# Altium schematic sheet handwriting_Sheet1.SchDoc
size B
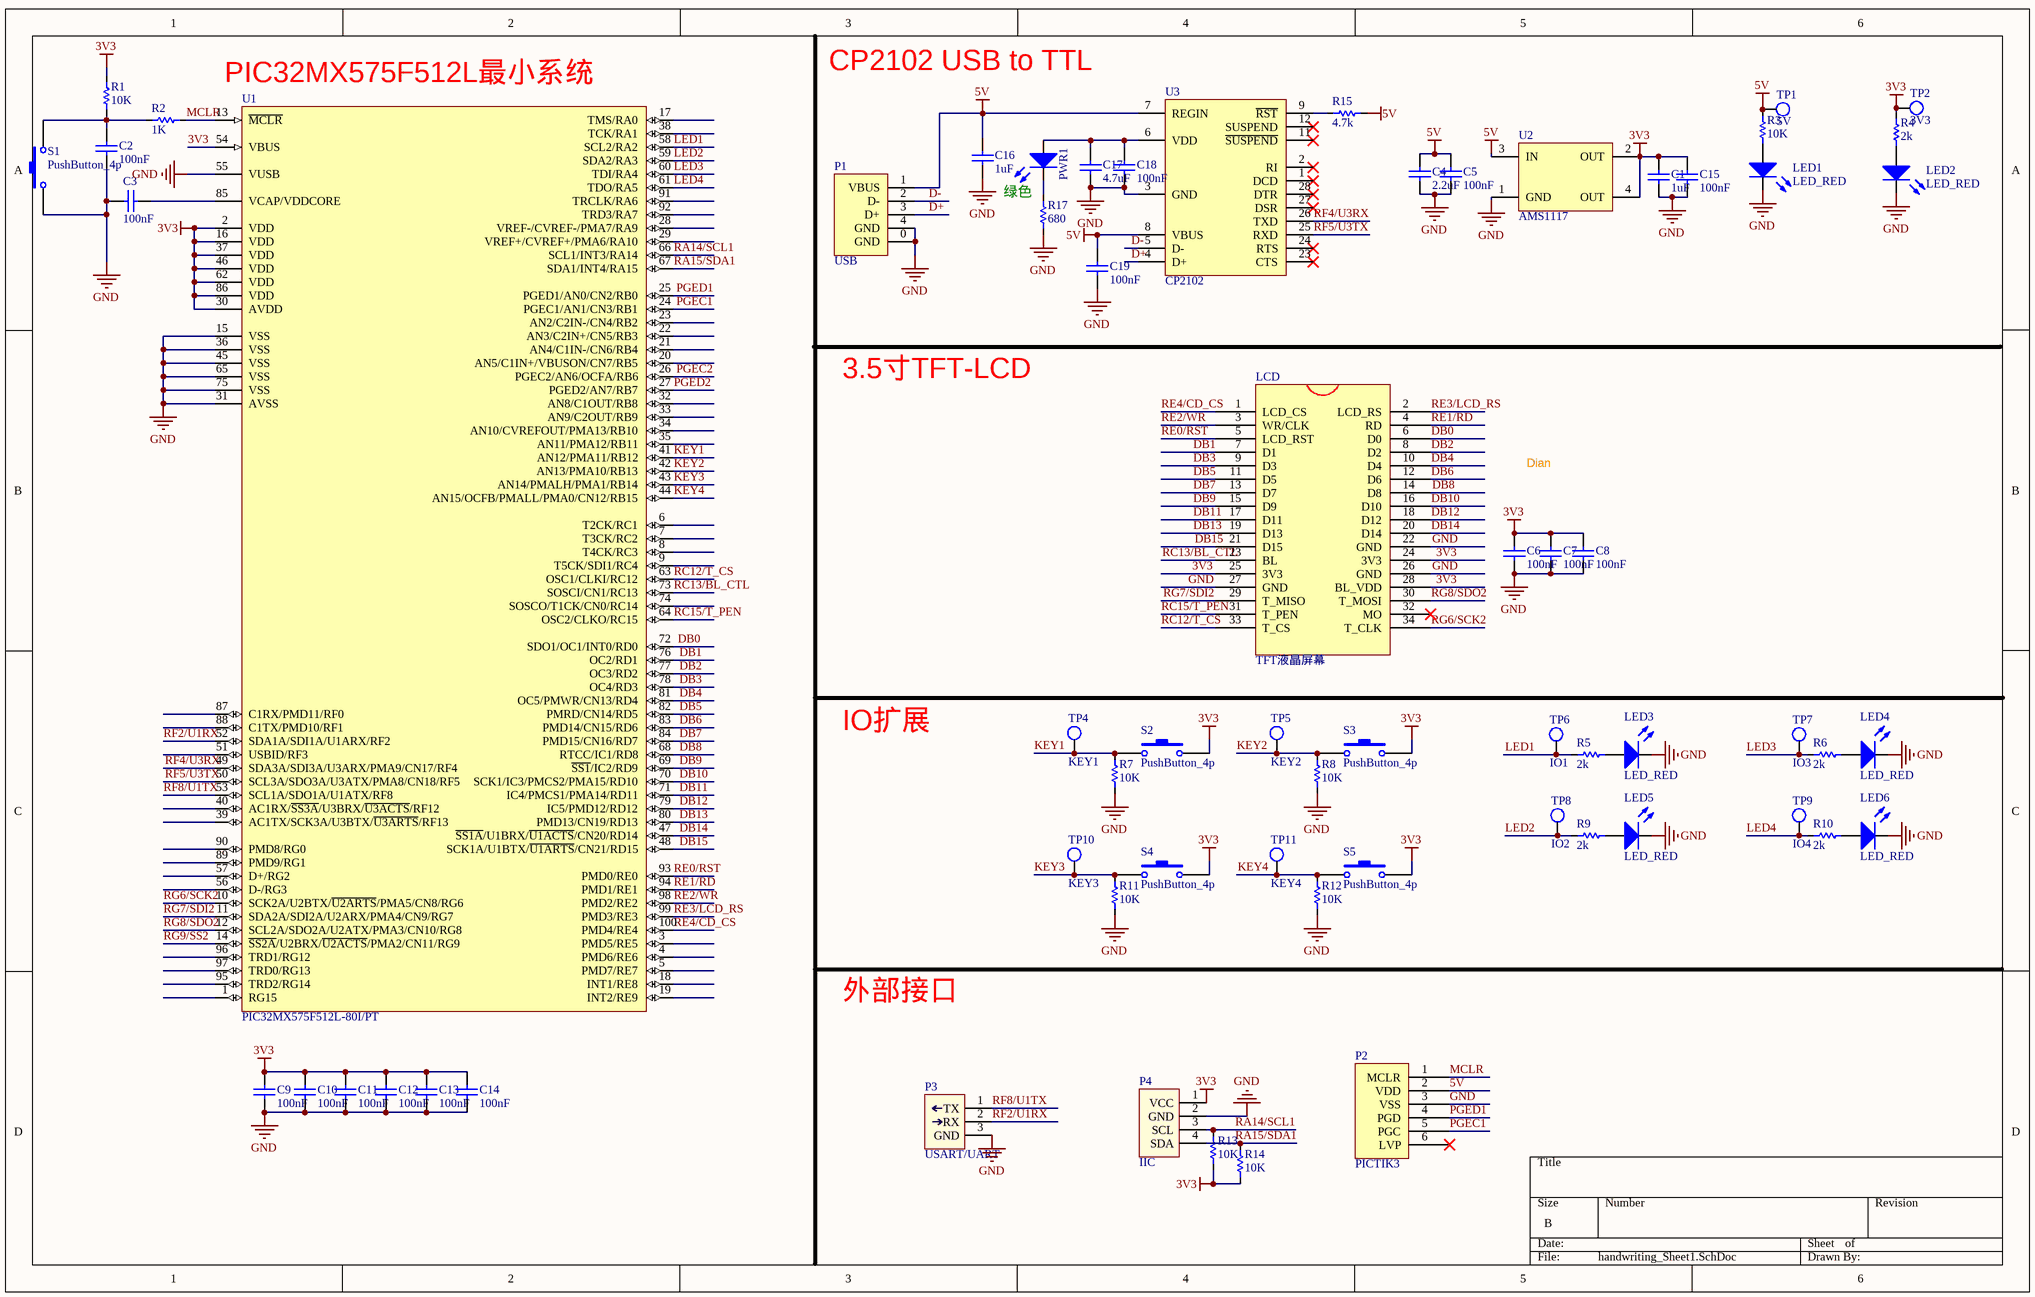
[diagram p0: handwriting_Sheet1.SchDoc]

## Parts
*  Dian_logo  [Dian_logo]  (value not drawn)
C1  1uF  [0603C]
C2  100nF  [0603C]
C3  100nF  [0603C]
C4  2.2uF  [0603C]
C5  100nF  [0603C]
C6  100nF  [0603C]
C7  100nF  [0603C]
C8  100nF  [0603C]
C9  100nF  [0603C]
C10  100nF  [0603C]
C11  100nF  [0603C]
C12  100nF  [0603C]
C13  100nF  [0603C]
C14  100nF  [0603C]
C15  100nF  [0603C]
C16  1uF  [0603C]
C17  4.7uF  [0603C]
C18  100nF  [0603C]
C19  100nF  [0603C]
LCD  TFT液晶屏幕  [TFT液晶屏]
LED1  LED_RED  [0603LED]
LED2  LED_RED  [0603LED]
LED3  LED_RED  [0603LED]
LED4  LED_RED  [0603LED]
LED5  LED_RED  [0603LED]
LED6  LED_RED  [0603LED]
P1  USB  [MICRO_USB_四脚]
P2  PICTIK3  [Pictik3]
P3  USART/UART  [HEADER 3x1 M]
P4  IIC  [HEADER 4x1]
PWR1  LED_RED  [0603led]  (value not drawn)
R1  10K  [0603R]
R2  1K  [0603R]
R3  10K  [0603R]
R4  2k  [0603R]
R5  2k  [0603R]
R6  2k  [0603R]
R7  10K  [0603R]
R8  10K  [0603R]
R9  2k  [0603R]
R10  2k  [0603R]
R11  10K  [0603R]
R12  10K  [0603R]
R13  10K  [0603R]
R14  10K  [0603R]
R15  4.7k  [0603R]
R17  680  [0603R]
S1  PushButton_4p  [SW-6x6mm]
S2  PushButton_4p  [SW-6x6mm]
S3  PushButton_4p  [SW-6x6mm]
S4  PushButton_4p  [SW-6x6mm]
S5  PushButton_4p  [SW-6x6mm]
TP1  5V  [TP_SMT]
TP2  3V3  [TP_SMT]
TP4  KEY1  [TP_SMT]
TP5  KEY2  [TP_SMT]
TP6  IO1  [TP_SMT]
TP7  IO3  [TP_SMT]
TP8  IO2  [TP_SMT]
TP9  IO4  [TP_SMT]
TP10  KEY3  [TP_SMT]
TP11  KEY4  [TP_SMT]
U1  PIC32MX575F512L-80I/PT  [TQFP-PT100_N]
U2  AMS1117  [SOT223_4]
U3  CP2102  [QFN-28_5x5x05P]

## Nets
3V3: C1.1 C6.2 C7.2 C8.2 C9.2 C10.2 C11.2 C12.2 C13.2 C14.2 C15.2 LCD.24(3V3) LCD.25(3V3) LCD.28(BL_VDD) P4.1(VCC) R1.2 R4.2 R13.1 R14.1 S2.2 S3.2 S4.2 S5.2 TP2.1(TP) U1.2(VDD) U1.16(VDD) U1.30(AVDD) U1.37(VDD) U1.46(VDD) U1.54(VBUS) U1.62(VDD) U1.86(VDD) U2.2(OUT) U2.4(OUT)
5V: C4.2 C5.2 C16.2 C19.2 P1.1(VBUS) P2.2(VDD) R3.2 R15.2 TP1.1(TP) U2.3(IN) U3.7(REGIN) U3.8(VBUS)
GND: C1.2 C2.1 C3.2 C4.1 C5.1 C6.1 C7.1 C8.1 C9.1 C10.1 C11.1 C12.1 C13.1 C14.1 C15.1 C16.1 C17.1 C18.1 C19.1 LCD.22(GND) LCD.26(GND) LCD.27(GND) LED1.2 LED2.2 LED3.2 LED4.2 LED5.2 LED6.2 P1.0(GND) P1.4(GND) P2.3(VSS) P3.3(GND) P4.2(GND) R7.1 R8.1 R11.1 R12.1 R17.1 S1.1 U1.15(VSS) U1.31(AVSS) U1.36(VSS) U1.45(VSS) U1.55(VUSB) U1.65(VSS) U1.75(VSS) U2.1(GND) U3.3(GND) U3.29(PAD)
D+: P1.3(D+) U3.4(D+)
D-: P1.2(D-) U3.5(D-)
DB0: LCD.6(D0) U1.72(SDO1/OC1/INT0/RD0)
DB1: LCD.7(D1) U1.76(OC2/RD1)
DB2: LCD.8(D2) U1.77(OC3/RD2)
DB3: LCD.9(D3) U1.78(OC4/RD3)
DB4: LCD.10(D4) U1.81(OC5/PMWR/CN13/RD4)
DB5: LCD.11(D5) U1.82(PMRD/CN14/RD5)
DB6: LCD.12(D6) U1.83(PMD14/CN15/RD6)
DB7: LCD.13(D7) U1.84(PMD15/CN16/RD7)
DB8: LCD.14(D8) U1.68(RTCC/IC1/RD8)
DB9: LCD.15(D9) U1.69(~{SS1}/IC2/RD9)
DB10: LCD.16(D10) U1.70(SCK1/IC3/PMCS2/PMA15/RD10)
DB11: LCD.17(D11) U1.71(IC4/PMCS1/PMA14/RD11)
DB12: LCD.18(D12) U1.79(IC5/PMD12/RD12)
DB13: LCD.19(D13) U1.80(PMD13/CN19/RD13)
DB14: LCD.20(D14) U1.47(~{SS1A}/U1BRX/~{U1ACTS}/CN20/RD14)
DB15: LCD.21(D15) U1.48(SCK1A/U1BTX/~{U1ARTS}/CN21/RD15)
KEY1: R7.2 S2.1 TP4.1(TP) U1.41(AN12/PMA11/RB12)
KEY2: R8.2 S3.1 TP5.1(TP) U1.42(AN13/PMA10/RB13)
KEY3: R11.2 S4.1 TP10.1(TP) U1.43(AN14/PMALH/PMA1/RB14)
KEY4: R12.2 S5.1 TP11.1(TP) U1.44(AN15/OCFB/PMALL/PMA0/CN12/RB15)
LED1: R5.2 TP6.1(TP) U1.58(SCL2/RA2)
LED2: R9.2 TP8.1(TP) U1.59(SDA2/RA3)
LED3: R6.2 TP7.1(TP) U1.60(TDI/RA4)
LED4: R10.2 TP9.1(TP) U1.61(TDO/RA5)
MCLR: P2.1(MCLR) R2.1 U1.13(~{MCLR})
PGEC1: P2.5(PGC) U1.24(PGEC1/AN1/CN3/RB1)
PGEC2: U1.26(PGEC2/AN6/OCFA/RB6)
PGED1: P2.4(PGD) U1.25(PGED1/AN0/CN2/RB0)
PGED2: U1.27(PGED2/AN7/RB7)
RA14/SCL1: P4.3(SCL) R13.2 U1.66(SCL1/INT3/RA14)
RA15/SDA1: P4.4(SDA) R14.2 U1.67(SDA1/INT4/RA15)
RC12/T_CS: LCD.33(T_CS) U1.63(OSC1/CLKI/RC12)
RC13/BL_CTL: LCD.23(BL) U1.73(SOSCI/CN1/RC13)
RC15/T_PEN: LCD.31(T_PEN) U1.64(OSC2/CLKO/RC15)
RE0/RST: LCD.5(LCD_RST) U1.93(PMD0/RE0)
RE1/RD: LCD.4(RD) U1.94(PMD1/RE1)
RE2/WR: LCD.3(WR/CLK) U1.98(PMD2/RE2)
RE3/LCD_RS: LCD.2(LCD_RS) U1.99(PMD3/RE3)
RE4/CD_CS: LCD.1(LCD_CS) U1.100(PMD4/RE4)
RF2/U1RX: P3.2(RX) U1.52(SDA1A/SDI1A/U1ARX/RF2)
RF4/U3RX: U1.49(SDA3A/SDI3A/U3ARX/PMA9/CN17/RF4) U3.26(TXD)
RF5/U3TX: U1.50(SCL3A/SDO3A/U3ATX/PMA8/CN18/RF5) U3.25(RXD)
RF8/U1TX: P3.1(TX) U1.53(SCL1A/SDO1A/U1ATX/RF8)
RG6/SCK2: LCD.34(T_CLK) U1.10(SCK2A/U2BTX/~{U2ARTS}/PMA5/CN8/RG6)
RG7/SDI2: LCD.29(T_MISO) U1.11(SDA2A/SDI2A/U2ARX/PMA4/CN9/RG7)
RG8/SDO2: LCD.30(T_MOSI) U1.12(SCL2A/SDO2A/U2ATX/PMA3/CN10/RG8)
RG9/SS2: U1.14(~{SS2A}/U2BRX/~{U2ACTS}/PMA2/CN11/RG9)
NetC2_2: C2.2 R1.1 R2.2 S1.2
NetC3_1: C3.1 U1.85(VCAP/VDDCORE)
NetC17_2: C17.2 C18.2 PWR1.1 U3.6(VDD)
NetLED1_1: LED1.1 R3.1
NetLED2_1: LED2.1 R4.1
NetLED3_1: LED3.1 R5.1
NetLED4_1: LED4.1 R6.1
NetLED5_1: LED5.1 R9.1
NetLED6_1: LED6.1 R10.1
NetPWR1_2: PWR1.2 R17.2
NetR15_1: R15.1 U3.9(~{RST})

Not connected (* = marked no-connect by the designer): LCD 32(MO)*; P2 6(LVP)*; S1 3 4; S2 3 4; S3 3 4; S4 3 4; S5 3 4; U1 1(RG15) 3(PMD5/RE5) 4(PMD6/RE6) 5(PMD7/RE7) 6(T2CK/RC1) 7(T3CK/RC2) 8(T4CK/RC3) 9(T5CK/SDI1/RC4) 17(TMS/RA0) 18(INT1/RE8) 19(INT2/RE9) 20(AN5/C1IN+/VBUSON/CN7/RB5) 21(AN4/C1IN-/CN6/RB4) 22(AN3/C2IN+/CN5/RB3) 23(AN2/C2IN-/CN4/RB2) 28(VREF-/CVREF-/PMA7/RA9) 29(VREF+/CVREF+/PMA6/RA10) 32(AN8/C1OUT/RB8) 33(AN9/C2OUT/RB9) 34(AN10/CVREFOUT/PMA13/RB10) 35(AN11/PMA12/RB11) 38(TCK/RA1) 39(AC1TX/SCK3A/U3BTX/~{U3ARTS}/RF13) 40(AC1RX/~{SS3A}/U3BRX/~{U3ACTS}/RF12) 51(USBID/RF3) 56(D-/RG3) 57(D+/RG2) 74(SOSCO/T1CK/CN0/RC14) 87(C1RX/PMD11/RF0) 88(C1TX/PMD10/RF1) 89(PMD9/RG1) 90(PMD8/RG0) 91(TRCLK/RA6) 92(TRD3/RA7) 95(TRD2/RG14) 96(TRD1/RG12) 97(TRD0/RG13); U3 1(DCD)* 2(RI)* 11(~{SUSPEND})* 12(SUSPEND)* 23(CTS)* 24(RTS)* 27(DSR)* 28(DTR)*

## Notes on the sheet
- (near U1) PIC32MX575F512L最小系统
- CP2102 USB to TTL
- 绿色
- 3.5寸TFT-LCD
- IO扩展
- 外部接口
- (in symbol Dian_logo) Dian

## Library data of the parts
C1-C19 = Cap: Capacitor; Value: 100pF; Published: 8-Jun-2000; LatestRevisionDate: 17-Jul-2002; LatestRevisionNote: Re-released for DXP Platform.; PackageReference: RAD-0.3; Publisher: Altium Limited; PackageDescription: Radial Cap, Thru-Hole; 2 Leads; 0.3 in Pin Spacing
LCD = TFT液晶屏幕: 原子外部接口
LED1-LED6 PWR1 = LED: Typical RED, GREEN, YELLOW, AMBER GaAs LED; Published: 8-Jun-2000; LatestRevisionDate: 17-Jul-2002; LatestRevisionNote: Re-released for DXP Platform.; PackageVersion: Feb-2002; PackageReference: 3.2X1.6X1.1; Publisher: Altium Limited; PackageDescription: SM LED; 2 Flat Leads
P3 = UART_3pin
R1 R3-R15 R17 = Res1: Resistor; Value: 1K; Published: 8-Jun-2000; LatestRevisionDate: 17-Jul-2002; LatestRevisionNote: Re-released for DXP Platform.; PackageReference: AXIAL-0.3; Publisher: Altium Limited; PackageDescription: Axial Device, Thru-Hole; 2 Leads; 0.3 in Pin Spacing
R2 = Res1: Resistor; Published: 8-Jun-2000; LatestRevisionDate: 17-Jul-2002; LatestRevisionNote: Re-released for DXP Platform.; PackageReference: AXIAL-0.3; Publisher: Altium Limited; PackageDescription: Axial Device, Thru-Hole; 2 Leads; 0.3 in Pin Spacing; Value: 1K
TP1 TP2 TP4-TP11 = TP: Test Point
U1 = PIC32MX575F512L-80I/PT: High Performance 80 MHz MIPS-Based 32-Bit Flash Microcontroller with USB and CAN, 512KB Program Memory, 100-pin TQFP, Industrial Temperature; Published: 2-Dec-2009; DatasheetVersion: revB, Nov-2009; PackageVersion: revBB, Aug-2009; PackageReference: TQFP-PT100; Publisher: Altium Limited; PackageDescription: 100-Lead Plastic Thin Quad Flatpack (PT) - 12x12x1mm Body, 2.00mm [TQFP]; Supplier 1: Digi-Key; Supplier Part Number 1: PIC32MX575F512L-80I/PT-ND; Supplier 2: Farnell; Supplier Part Number 2: 1778962; ComponentLink1Description: Datasheet; ComponentLink1URL: http://ww1.microchip.com/downloads/en/DeviceDoc/DS-61156B.pdf; ComponentLink2Description: Packaging Specification; ComponentLink2URL: http://ww1.microchip.com/downloads/en/PackagingSpec/en012702.pdf; ComponentLink3Description: Microchip.com Home; ComponentLink3URL: http://www.microchip.com/